# Altium schematic sheet MCU.SchDoc
size A4
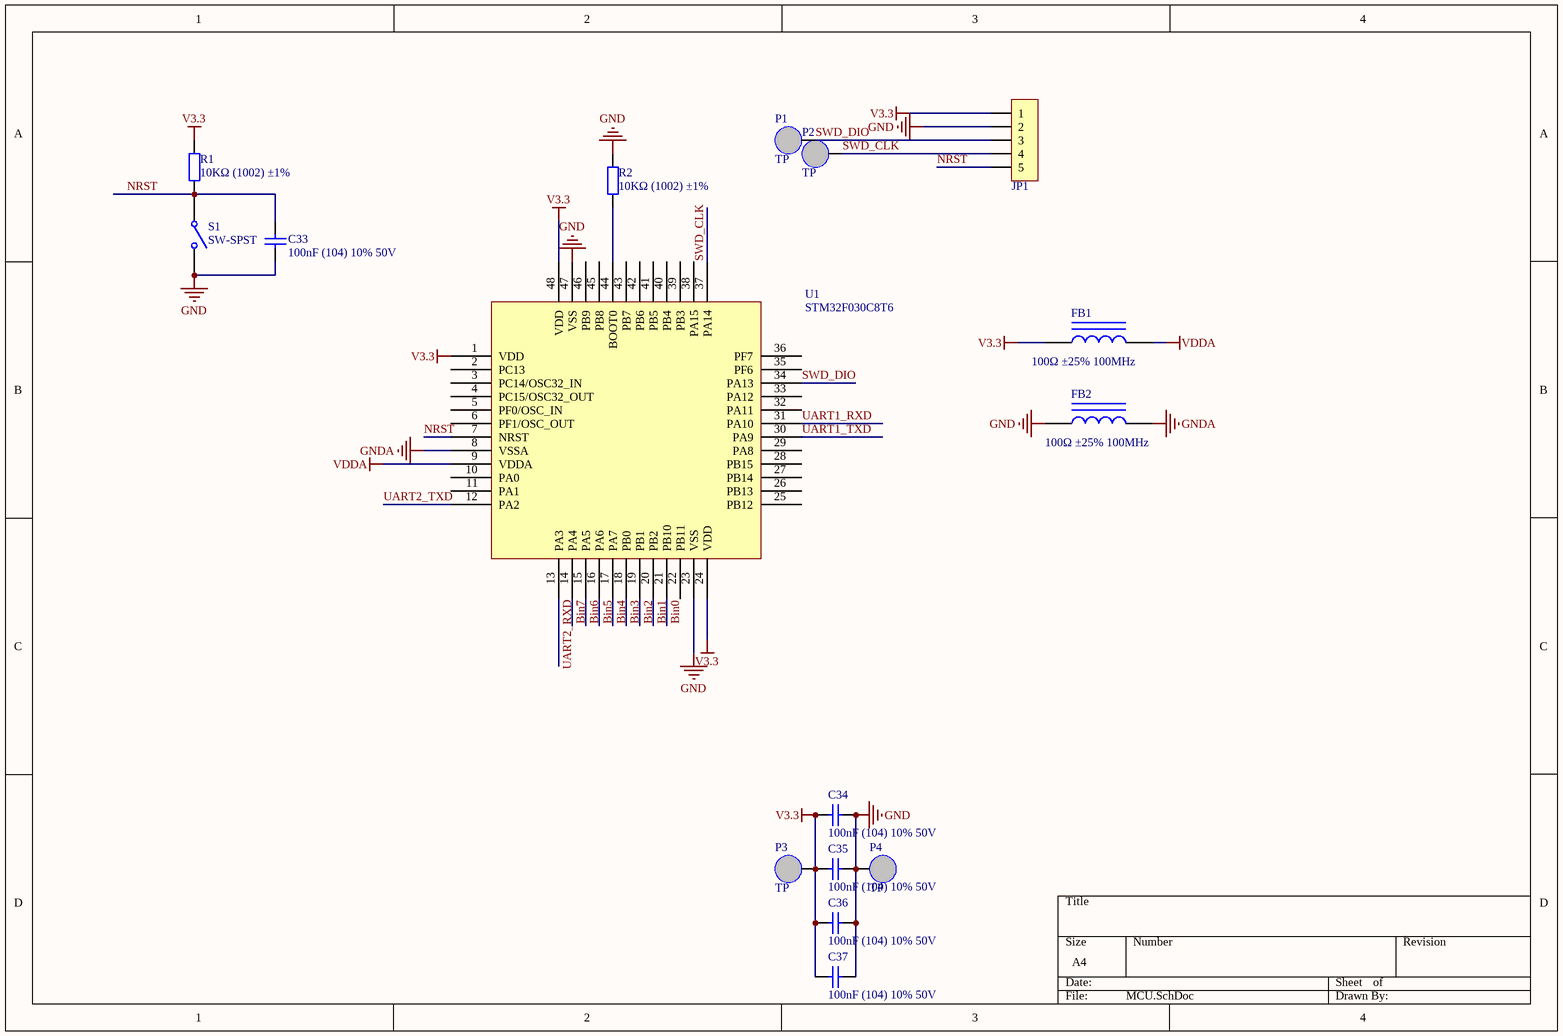
[diagram p0: MCU.SchDoc]

## Parts
C33  100nF (104) 10% 50V  [0603_C]
C34  100nF (104) 10% 50V  [0603_C]
C35  100nF (104) 10% 50V  [0603_C]
C36  100nF (104) 10% 50V  [0603_C]
C37  100nF (104) 10% 50V  [0603_C]
FB1  100Ω ±25% 100MHz  [0805_L]
FB2  100Ω ±25% 100MHz  [0805_L]
JP1  HDR-1X5  [XH2.54-LI-5P]  (value not drawn)
P1  TP  [TP]
P2  TP  [TP]
P3  TP  [TP]
P4  TP  [TP]
R1  10KΩ (1002) ±1%  [0805_R]
R2  10KΩ (1002) ±1%  [0603_R]
S1  SW-SPST  [TSW SMD-3*6*2.5]
U1  STM32F030C8T6  [LQFP-48_7x7x05P]

## Nets
GND: C33.1 C34.2 C35.2 C36.2 C37.2 FB2.1 JP1.2 P4.1 R2.2 S1.2(NO) U1.23(VSS) U1.47(VSS)
GNDA: FB2.2 U1.8(VSSA)
V3.3: C34.1 C35.1 C36.1 C37.1 FB1.1 JP1.1 P3.1 R1.2 U1.1(VDD) U1.24(VDD) U1.48(VDD)
VDDA: FB1.2 U1.9(VDDA)
Bin0: U1.21(PB10)
Bin1: U1.20(PB2)
Bin2: U1.19(PB1)
Bin3: U1.18(PB0)
Bin4: U1.17(PA7)
Bin5: U1.16(PA6)
Bin6: U1.15(PA5)
Bin7: U1.14(PA4)
NRST: C33.2 JP1.5 R1.1 S1.1(COMMON) U1.7(NRST)
SWD_CLK: JP1.4 P2.1 U1.37(PA14)
SWD_DIO: JP1.3 P1.1 U1.34(PA13)
UART1_RXD: U1.31(PA10)
UART1_TXD: U1.30(PA9)
UART2_RXD: U1.13(PA3)
UART2_TXD: U1.12(PA2)
NetR2_1: R2.1 U1.44(BOOT0)

Not connected (* = marked no-connect by the designer): U1 2(PC13) 3(PC14/OSC32_IN) 4(PC15/OSC32_OUT) 5(PF0/OSC_IN) 6(PF1/OSC_OUT) 10(PA0) 11(PA1) 22(PB11) 25(PB12) 26(PB13) 27(PB14) 28(PB15) 29(PA8) 32(PA11) 33(PA12) 35(PF6) 36(PF7) 38(PA15) 39(PB3) 40(PB4) 41(PB5) 42(PB6) 43(PB7) 45(PB8) 46(PB9)

## Library data of the parts
C33-C37 = 0603 100nF (104) 10% 50V: 贴片电容; ComponentLink1Description: 供应商链接; ComponentLink1URL: http://www.szlcsc.com/product/details_15331.html; Package: 0603; Supplier: LC; SuppliersPartNumber: C14663
FB1 FB2 = 0805 100Ω 25% 100MHz: 贴片磁珠; ComponentLink1Description: 供应商链接; ComponentLink1URL: http://www.szlcsc.com/product/details_1367.html; Package: 0805; Supplier: LC; SuppliersPartNumber: C1015
JP1 = Header 5: 5P接插件; 版权归属: 源创客; BOM名称: 5P接插件; 学习资源: www.ooocke.com
R1 = 0805 10KΩ (1002) 1%: 贴片电阻; ComponentLink1Description: 供应商链接; ComponentLink1URL: http://www.szlcsc.com/product/details_18102.html; Package: 0805; Supplier: LC; SuppliersPartNumber: C17414
R2 = 0603 10KΩ (1002) 1%: 贴片电阻; ComponentLink1Description: 供应商链接; ComponentLink1URL: http://www.szlcsc.com/product/details_26547.html; Package: 0603; Supplier: LC; SuppliersPartNumber: C25804
S1 = SW-SPST: Single-Pole, Single-Throw Switch; Published: 24-Mar-1999; LatestRevisionDate: 17-Jul-2002; LatestRevisionNote: Re-released for DXP Platform.; PackageReference: SPST-2; Publisher: Altium Limited; PackageDescription: Switch; 2 Leads
U1 = STM32F030C8T6: ARM; ComponentLink1Description: 供应商链接; ComponentLink1URL: http://www.szlcsc.com/product/details_24662.html; Package: LQFP-48_7x7x05P; Supplier: LC; SuppliersPartNumber: C23922